# Altium schematic sheet 01_Power_Control.SchDoc: POWER AND CONTROL
size A4; Author: Henrique Rosa; DrawnBy: Henq / Codex; Engineer: Henrique Rosa; Address1: rua; Address: Bairro; Address3: São Paulo, SP - Brasil; Address4: 55 (11) 9 6825-6715; DocumentNumber: GBS-01; Revision: 1.0; SheetNumber: 02; SheetTotal: 06; Site: henq.com; VersionControl_RevNumber: 03; PageSetup: Record=PageOptions|CenterHorizontal=True|CenterVertical=True|PrintScale=0.98|XCorrection=1.00|YCorrection=1.00|PrintKind=0|BorderSize=5000000|LeftOffset=0|BottomOffset=0|Orientation=2|PaperLength=1000|PaperWidth=1000|Scale=100|PaperSource=7|PrintQuality=-3|MediaType=1|DitherType=10|PrintScaleMode=1|PaperKind=A4|PaperIndex=9
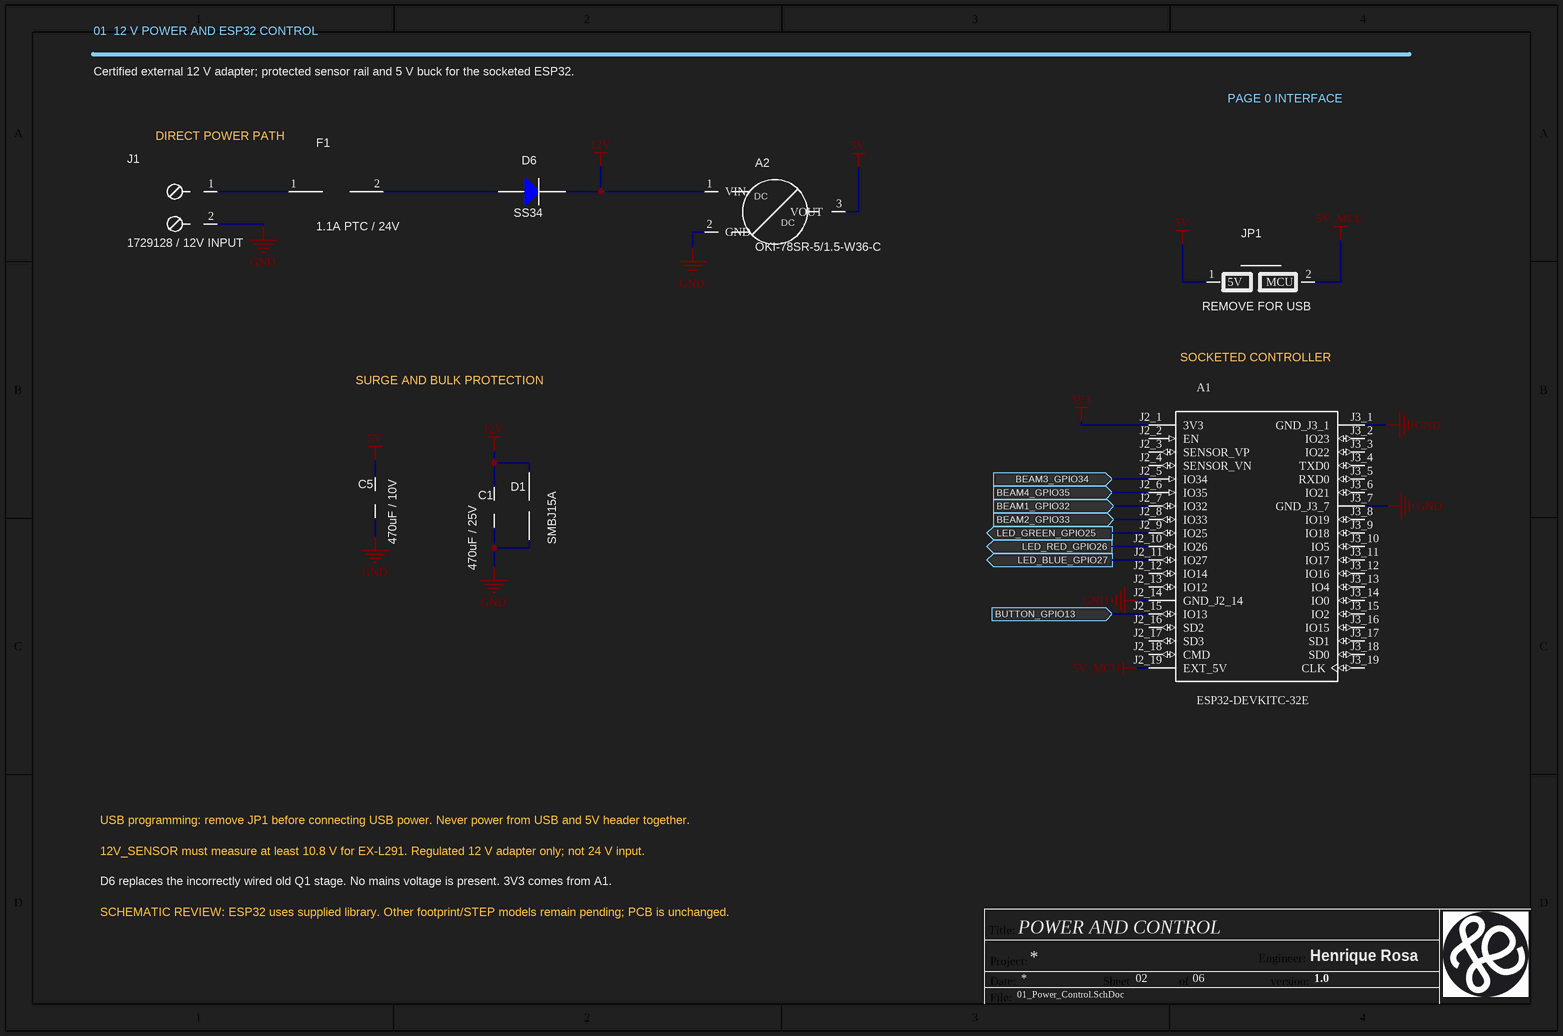
[diagram p0: 01_Power_Control.SchDoc]

## Parts
A1  ESP32-DEVKITC-32E  [MODULE_ESP32-DEVKITC-32E]
A2  OKI-78SR-5/1.5-W36-C  [MURATA_OKI78SR_VERTICAL]
C1  470uF / 25V  [PANASONIC_EEUFR1E471_D10_P5]
C5  470uF / 10V  [PANASONIC_EEUFR1A471_D8_P3_5]
D1  SMBJ15A  [SMBJ15A_A1_K2]
D6  SS34  [SS34_A1_K2]
F1  1.1A PTC / 24V  [BOURNS_MFMSMF110_24X_STYLE2]
J1  1729128 / 12V INPUT  [PHOENIX_1729128_MKDSN_2_508]
JP1  REMOVE FOR USB  [SAMTEC_TSW102_07_SINGLE]

## Ports
BEAM1_GPIO32 (in), BEAM2_GPIO33 (in), BEAM3_GPIO34 (in), BEAM4_GPIO35 (in), BUTTON_GPIO13 (in), LED_BLUE_GPIO27 (out), LED_GREEN_GPIO25 (out), LED_RED_GPIO26 (out)

## Nets
3V3: A1.J2_1(3V3)
5V: A2.3(VOUT) C5.2 JP1.1(5V)
5V_MCU: A1.J2_19(EXT_5V) JP1.2(MCU)
12V: A2.1(VIN) C1.2 D1.2(K) D6.2(K)
GND: A1.J2_14(GND_J2_14) A1.J3_1(GND_J3_1) A1.J3_7(GND_J3_7) A2.2(GND) C1.1 C5.1 D1.1(A) J1.2(0V)
BEAM1_GPIO32: A1.J2_7(IO32) ; port BEAM1_GPIO32
BEAM2_GPIO33: A1.J2_8(IO33) ; port BEAM2_GPIO33
BEAM3_GPIO34: A1.J2_5(IO34) ; port BEAM3_GPIO34
BEAM4_GPIO35: A1.J2_6(IO35) ; port BEAM4_GPIO35
BUTTON_GPIO13: A1.J2_15(IO13) ; port BUTTON_GPIO13
LED_BLUE_GPIO27: A1.J2_11(IO27) ; port LED_BLUE_GPIO27
LED_GREEN_GPIO25: A1.J2_9(IO25) ; port LED_GREEN_GPIO25
LED_RED_GPIO26: A1.J2_10(IO26) ; port LED_RED_GPIO26
NetD6_1: D6.1(A) F1.2
NetF1_1: F1.1 J1.1(+12V)

Not connected (* = marked no-connect by the designer): A1 J2_2(EN) J2_3(SENSOR_VP) J2_4(SENSOR_VN) J2_12(IO14) J2_13(IO12) J2_16(SD2) J2_17(SD3) J2_18(CMD) J3_2(IO23) J3_3(IO22) J3_4(TXD0) J3_5(RXD0) J3_6(IO21) J3_8(IO19) J3_9(IO18) J3_10(IO5) J3_11(IO17) J3_12(IO16) J3_13(IO4) J3_14(IO0) J3_15(IO2) J3_16(IO15) J3_17(SD1) J3_18(SD0) J3_19(CLK)

## Notes on the sheet
- 01  12 V POWER AND ESP32 CONTROL
- Certified external 12 V adapter; protected sensor rail and 5 V buck for the socketed ESP32.
- PAGE 0 INTERFACE
- DIRECT POWER PATH
- SURGE AND BULK PROTECTION
- SOCKETED CONTROLLER
- USB programming: remove JP1 before connecting USB power. Never power from USB and 5V header together.
- 12V_SENSOR must measure at least 10.8 V for EX-L291. Regulated 12 V adapter only; not 24 V input.
- D6 replaces the incorrectly wired old Q1 stage. No mains voltage is present. 3V3 comes from A1.
- SCHEMATIC REVIEW: ESP32 uses supplied library. Other footprint/STEP models remain pending; PCB is unchanged.
- Title:
- Project:
- Date:
- Sheet
- of
- Engineer:
- version:
- File:
- Title
- Size:
- A4
- Number:
- Time:
- Revision:
- (in symbol *) DC

## Library data of the parts
A1 = ESP32-DEVKITC-32E: The ESP32-DEVKITC-32E transceiver evaluation board from Espressif Systems is a powerful development tool for wireless communication technologies. It supports 802.11 b/g/n Wi-Fi and BluetoothÂ® Smart Ready 4.x (BLE) dual-mode at 2.4GHz, making it ideal for; CAD status: Reusable reviewed symbol; pin/pad check performed by refresh. Native ERC, PCB ECO and 3D mechanical inspection still required.; Component refresh: 2026-09-10 sourced-symbol pass; not manufacturing release; Symbol adaptation: Keep existing part-specific symbol; package and procurement metadata retained.; SnapEDA_Link: https://www.snapeda.com/parts/ESP32-DEVKITC-32E/Espressif+Systems/view-part/?ref=snap; Package: None; Value: ESP32-DevKitC-32E; MF: Espressif Systems; MP: ESP32-DEVKITC-32E; Check_prices: https://www.snapeda.com/parts/ESP32-DEVKITC-32E/Espressif+Systems/view-part/?ref=eda; Manufacturer: Espressif Systems; Manufacturer Part Number: ESP32-DevKitC-32E; Part Number: ESP32-DevKitC-32E; Intended footprint: MODULE_ESP32-DEVKITC-32E
A2 = *: 12 V to regulated 5 V DC/DC module; Manufacturer: Murata; Populate: Yes; CAD status: Reusable reviewed symbol; pin/pad check performed by refresh. Native ERC, PCB ECO and 3D mechanical inspection still required.; Symbol provenance: Project-authored native Altium library; based on identified manufacturer part and pinout, not vendor-issued CAD; Component refresh: 2026-09-10 sourced-symbol pass; not manufacturing release; Symbol adaptation: Keep existing part-specific symbol; package and procurement metadata retained.; Manufacturer Part Number: OKI-78SR-5/1.5-W36-C; Package: SIP3_BUCK; Intended footprint: MURATA_OKI78SR_VERTICAL; Datasheet: https://www.murata.com/products/productdata/8807037992990/oki-78sr.pdf; Part Number: OKI-78SR-5/1.5-W36-C; Value: OKI-78SR-5/1.5-W36-C
C1 = Capacitor Cerâmico SMD: Protected 12 V bulk capacitor; Part Number: EEU-FR1E471; Manufacturer: Panasonic; Symbol source: Celestial / Mark Harris / SCH - PASSIVES - POLARISED CAPACITOR.SCHLIB / Polarised Capacitor; CAD status: Reusable reviewed symbol; pin/pad check performed by refresh. Native ERC, PCB ECO and 3D mechanical inspection still required.; Polarity: Pin 1 positive; pin 2 negative; Component refresh: 2026-09-10 sourced-symbol pass; not manufacturing release; Symbol adaptation: Import Celestial symbol artwork; retain physical pin identities and positions; lead extensions adapt the symbol to existing wiring.; Valor: 470uF / 25V; Manufacturer Part Number: EEU-FR1E471; Intended footprint: PANASONIC_EEUFR1E471_D10_P5; Footprint source: Local PinRepairFootprints.PcbLib; source and polarity checked; Value: 470uF / 25V
C5 = Capacitor Cerâmico SMD: ESP32 Wi-Fi peak-current reservoir; Part Number: EEU-FR1A471; Manufacturer: Panasonic; Symbol source: Celestial / Mark Harris / SCH - PASSIVES - POLARISED CAPACITOR.SCHLIB / Polarised Capacitor; CAD status: Reusable reviewed symbol; pin/pad check performed by refresh. Native ERC, PCB ECO and 3D mechanical inspection still required.; Polarity: Pin 1 positive; pin 2 negative; Component refresh: 2026-09-10 sourced-symbol pass; not manufacturing release; Symbol adaptation: Import Celestial symbol artwork; retain physical pin identities and positions; lead extensions adapt the symbol to existing wiring.; Valor: 470uF / 10V; Manufacturer Part Number: EEU-FR1A471; Intended footprint: PANASONIC_EEUFR1A471_D8_P3_5; Footprint source: Local PinRepairFootprints.PcbLib; source and polarity checked; Value: 470uF / 10V
D1 = Diode: 15 V TVS suppressor - cathode to positive rail; Manufacturer: Littelfuse; Symbol source: Celestial / Mark Harris / SCH - DIODES - DIODE TVS UNI.SCHLIB / DIODE TVS UNI; CAD status: Reusable reviewed symbol; pin/pad check performed by refresh. Native ERC, PCB ECO and 3D mechanical inspection still required.; Component refresh: 2026-09-10 sourced-symbol pass; not manufacturing release; Symbol adaptation: Import Celestial symbol artwork; retain physical pin identities and positions; lead extensions adapt the symbol to existing wiring.; Value: SMBJ15A; Part Number: SMBJ15A; Manufacturer Part Number: SMBJ15A; Intended footprint: SMBJ15A_A1_K2; Footprint source: Local PinRepairFootprints.PcbLib; source and polarity checked
D6 = Diode: Series reverse-polarity Schottky diode; Manufacturer: Vishay; Value: SS34-E3/57T; Symbol source: Conventional symbol reused from ENERGY.SchDoc; CAD status: Reusable reviewed symbol; pin/pad check performed by refresh. Native ERC, PCB ECO and 3D mechanical inspection still required.; Component refresh: 2026-09-10 sourced-symbol pass; not manufacturing release; Symbol adaptation: Retain existing diode symbol for SS34; dedicated Schottky glyph remains a follow-up (not silently replaced with TVS/rectifier artwork).; Part Number: SS34-E3/57T; Manufacturer Part Number: SS34-E3/57T; Intended footprint: SS34_A1_K2; Footprint source: Local PinRepairFootprints.PcbLib; source and polarity checked
F1 = *: Resettable 12 V input fuse; Manufacturer: Bourns; Manufacturer Part Number: MF-MSMF110/24X-2; Populate: Yes; CAD status: Reusable reviewed symbol; pin/pad check performed by refresh. Native ERC, PCB ECO and 3D mechanical inspection still required.; Value: MF-MSMF110/24X-2; Component refresh: 2026-09-10 sourced-symbol pass; not manufacturing release; Symbol source: Celestial / Mark Harris / SCH - PASSIVES - THERMISTOR PTC.SCHLIB / Thermistor PTC; Symbol adaptation: Import Celestial symbol artwork; retain physical pin identities and positions; lead extensions adapt the symbol to existing wiring.; Package: F1812; Intended footprint: BOURNS_MFMSMF110_24X_STYLE2; Footprint source: Local PinRepairFootprints.PcbLib; source and polarity checked; Part Number: MF-MSMF110/24X-2; Voltage rating: 24 V
J1 = *: Two-position 5.08 mm screw terminal; Manufacturer: Phoenix Contact; Populate: Yes; CAD status: Reusable reviewed symbol; pin/pad check performed by refresh. Native ERC, PCB ECO and 3D mechanical inspection still required.; Symbol provenance: Project-authored native Altium library; based on identified manufacturer part and pinout, not vendor-issued CAD; Component refresh: 2026-09-10 sourced-symbol pass; not manufacturing release; Symbol adaptation: Keep existing part-specific symbol; package and procurement metadata retained.; Manufacturer Part Number: 1729128; Package: TERM_2_508; Intended footprint: PHOENIX_1729128_MKDSN_2_508; Part Number: 1729128; Value: 1729128
JP1 = *: External 5 V disconnect; fit shunt only without USB; Manufacturer: Samtec; Manufacturer Part Number: TSW-102-07-G-S; Populate: Yes; CAD status: Reusable reviewed symbol; pin/pad check performed by refresh. Native ERC, PCB ECO and 3D mechanical inspection still required.; Value: TSW-102-07-G-S; Component refresh: 2026-09-10 sourced-symbol pass; not manufacturing release; Symbol adaptation: Keep existing part-specific symbol; package and procurement metadata retained.; Package: HEADER_1X02_2.54; Intended footprint: SAMTEC_TSW102_07_SINGLE; Footprint source: Local PinRepairFootprints.PcbLib; source and polarity checked; Part Number: TSW-102-07-G-S